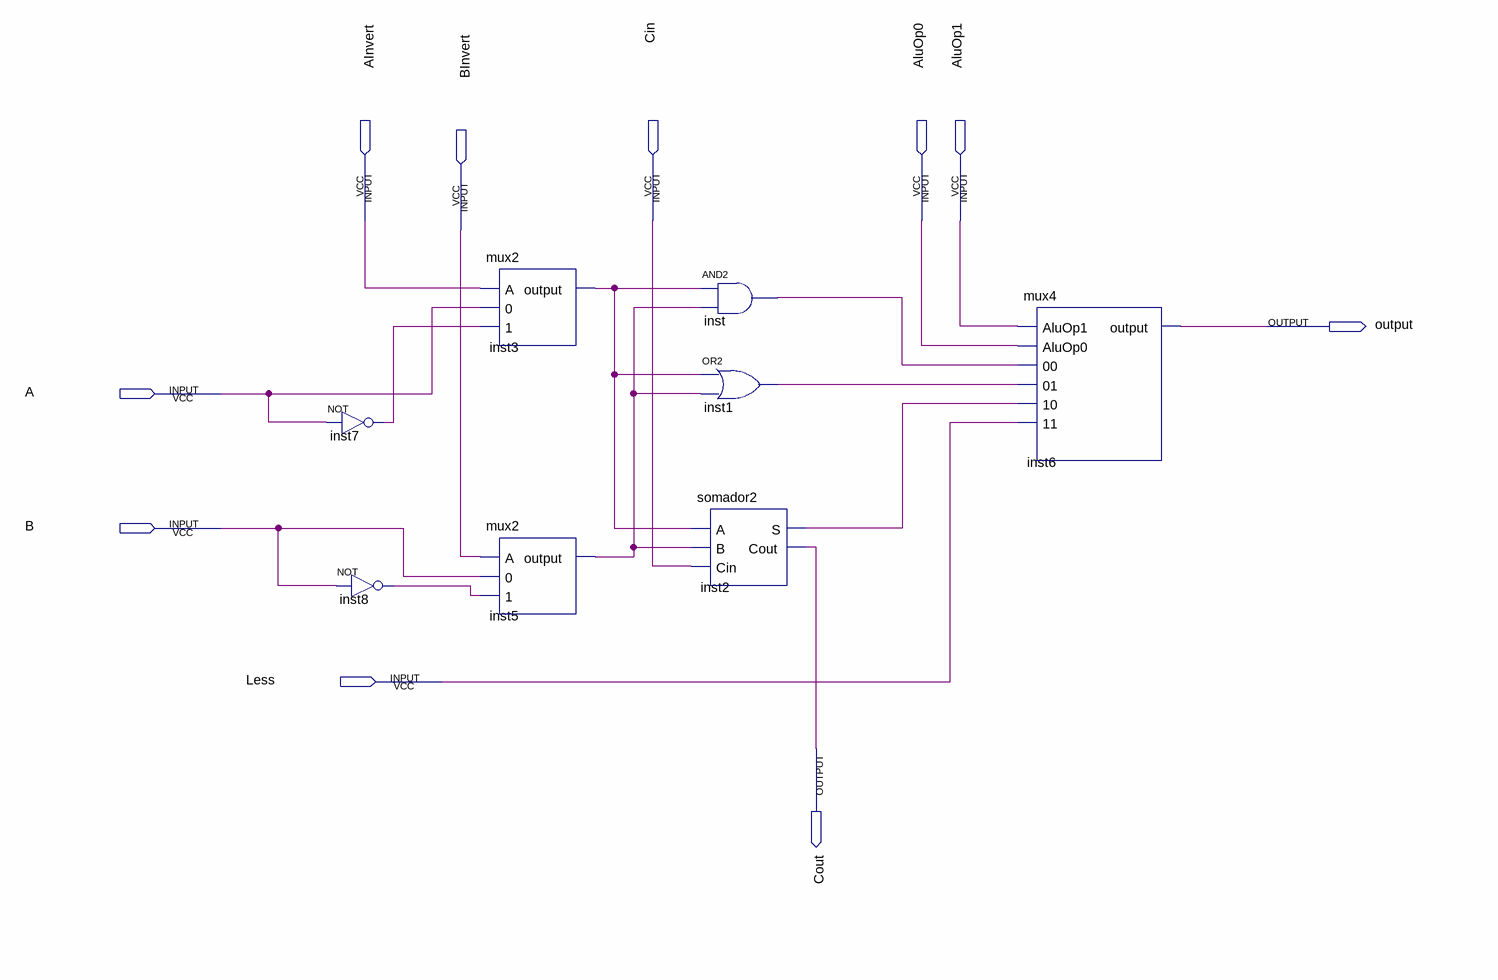
[diagram p0: schematic sheet]
// Quartus schematic ula1.bdf as structural Verilog: 8 symbols, 10 pins
module ula1 (
  input  AInvert,
  input  Cin,
  input  AluOp0,
  input  AluOp1,
  input  BInvert,
  input  A,
  input  B,
  input  Less,
  output \output ,
  output Cout
);

  wire inst1_out, inst2_s, inst3_output, inst5_output, inst7_out, inst8_out, inst_out;

  not inst7 (inst7_out, A);
  not inst8 (inst8_out, B);
  mux2 inst3 (.A(AInvert), .\0 (A), .\1 (inst7_out), .\output (inst3_output));
  mux2 inst5 (.A(BInvert), .\0 (B), .\1 (inst8_out), .\output (inst5_output));
  and inst (inst_out, inst3_output, inst5_output);
  or inst1 (inst1_out, inst3_output, inst5_output);
  somador2 inst2 (.A(inst3_output), .B(inst5_output), .Cin(Cin), .S(inst2_s), .Cout(Cout));
  mux4 inst6 (
    .AluOp1(AluOp1), .AluOp0(AluOp0), .\00 (inst_out), .\01 (inst1_out), .\10 (inst2_s), .\11 (Less),
    .\output (\output ));
endmodule
